# Altium schematic sheet EvaluationV1.0.SchDoc
size 340 x 245 mm
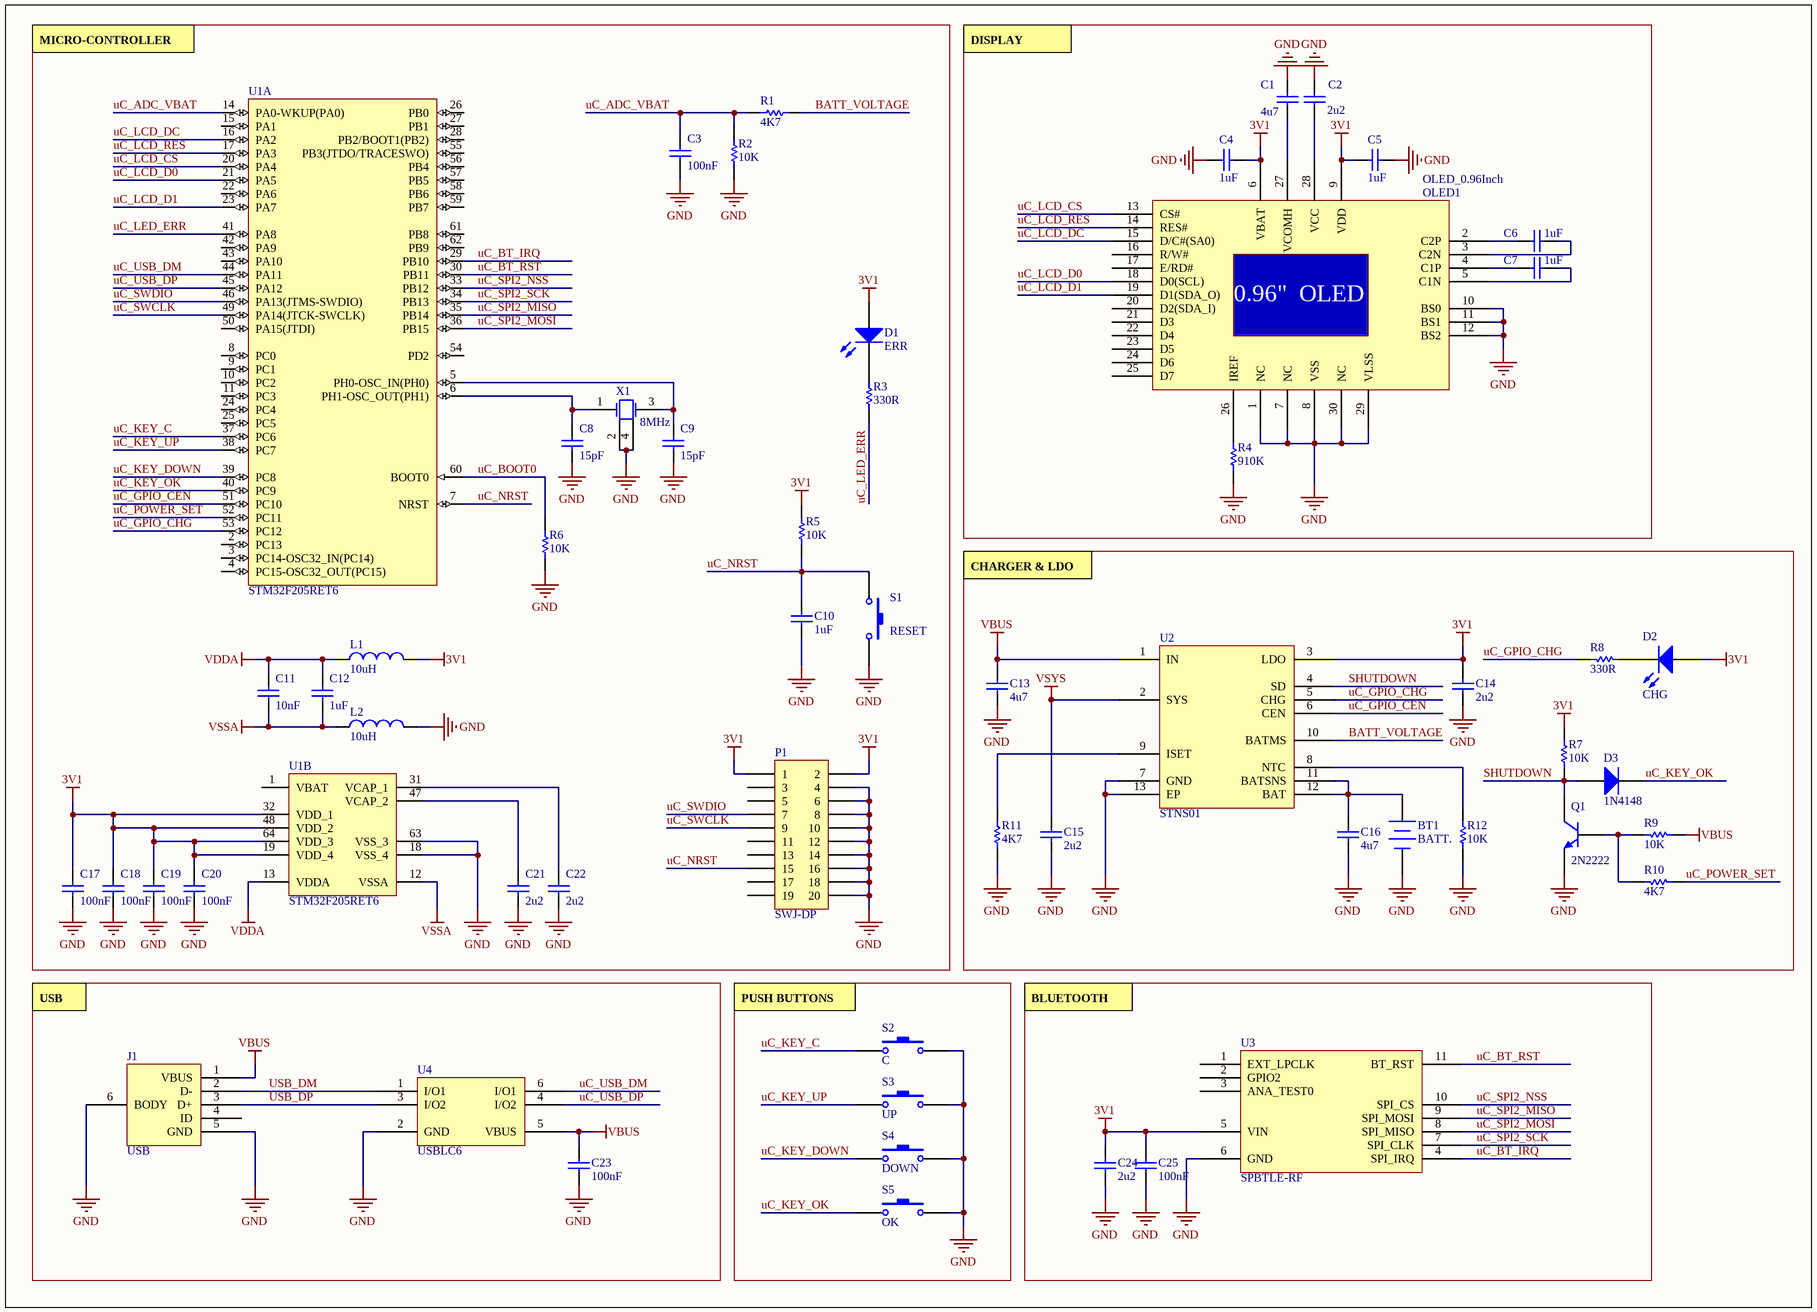
[diagram p0: EvaluationV1.0.SchDoc]

## Parts
BT1  BATT.  [PH B2B]
C1  4u7  [CAP 0805]
C2  2u2  [CAP 0805]
C3  100nF  [CAP 0805]
C4  1uF  [CAP 0805]
C5  1uF  [CAP 0805]
C6  1uF  [CAP 0805]
C7  1uF  [CAP 0805]
C8  15pF  [CAP 0805]
C9  15pF  [CAP 0805]
C10  1uF  [CAP 0805]
C11  10nF  [CAP 0805]
C12  1uF  [CAP 0805]
C13  4u7  [CAP 0805]
C14  2u2  [CAP 0805]
C15  2u2  [CAP 0805]
C16  4u7  [CAP 0805]
C17  100nF  [CAP 0805]
C18  100nF  [CAP 0805]
C19  100nF  [CAP 0805]
C20  100nF  [CAP 0805]
C21  2u2  [CAP 0805]
C22  2u2  [CAP 0805]
C23  100nF  [CAP 0805]
C24  2u2  [CAP 0805]
C25  100nF  [CAP 0805]
D1  ERR  [LED 0805]
D2  CHG  [LED 0805]
D3  1N4148  [DIODE SOD-80]
J1  USB  [USB_MICRO]
L1  10uH  [RES 0805]
L2  10uH  [RES 0805]
OLED1  OLED_0.96Inch  [OLED 0.96"]
P1  SWJ-DP  [BOX 2X10]
Q1  2N2222  [SOT23]
R1  4K7  [RES 0805]
R2  10K  [RES 0805]
R3  330R  [RES 0805]
R4  910K  [RES 0805]
R5  10K  [RES 0805]
R6  10K  [RES 0805]
R7  10K  [RES 0805]
R8  330R  [RES 0805]
R9  10K  [RES 0805]
R10  4K7  [RES 0805]
R11  4K7  [RES 0805]
R12  10K  [RES 0805]
S1  RESET  [SW SMD 6x6x5]
S2  C  [SW SMD 6x6x5]
S3  UP  [SW SMD 6x6x5]
S4  DOWN  [SW SMD 6x6x5]
S5  OK  [SW SMD 6x6x5]
U1  STM32F205RET6  [LQFP64_N]  (parts A,B of 2)
U2  STNS01  [DFN12-3x3]
U3  SPBTLE-RF  [SPBTLE-RF]
U4  USBLC6  [SOT-666]
X1  8MHz  [ABMM2]

## Nets
3V1: C4.2 C5.2 C14.1 C17.2 C18.2 C19.2 C20.2 C24.1 C25.1 D1.1(A) D2.1(A) L1.1 OLED1.6(VBAT) OLED1.9(VDD) P1.1 P1.2 R5.2 R7.1 U1.19(VDD_4) U1.32(VDD_1) U1.48(VDD_2) U1.64(VDD_3) U2.3(LDO) U3.5(VIN)
GND: BT1.2(-) C1.1 C2.1 C3.1 C4.1 C5.1 C8.1 C9.1 C10.2 C13.2 C14.2 C15.2 C16.2 C17.1 C18.1 C19.1 C20.1 C21.1 C22.1 C23.1 C24.2 C25.2 J1.5(GND) J1.6(BODY) L2.1 OLED1.1(NC) OLED1.7(NC) OLED1.8(VSS) OLED1.10(BS0) OLED1.11(BS1) OLED1.12(BS2) OLED1.29(VLSS) OLED1.30(NC) P1.4 P1.6 P1.8 P1.10 P1.12 P1.14 P1.16 P1.18 P1.20 Q1.3(E) R2.2 R4.1 R6.1 R11.1 R12.1 S1.2 S2.2 S3.2 S4.2 S5.2 U1.18(VSS_4) U1.63(VSS_3) U2.7(GND) U2.13(EP) U3.6(GND) U4.2(GND) X1.2 X1.4
VBUS: C13.1 C23.2 J1.1(VBUS) R9.1 U2.1(IN) U4.5(VBUS)
VDDA: C11.2 C12.2 L1.2 U1.13(VDDA)
VSSA: C11.1 C12.1 L2.2 U1.12(VSSA)
VSYS: C15.1 U2.2(SYS)
BATT_VOLTAGE: R1.1 U2.10(BATMS)
SHUTDOWN: D3.1(A) Q1.2(C) R7.2 U2.4(SD)
uC_ADC_VBAT: C3.2 R1.2 R2.1 U1.14(PA0-WKUP(PA0))
uC_BOOT0: R6.2 U1.60(BOOT0)
uC_BT_IRQ: U1.29(PB10) U3.4(SPI_IRQ)
uC_BT_RST: U1.30(PB11) U3.11(BT_RST)
uC_GPIO_CEN: U1.51(PC10) U2.6(CEN)
uC_GPIO_CHG: R8.1 U1.53(PC12) U2.5(CHG)
uC_KEY_C: S2.1 U1.37(PC6)
uC_KEY_DOWN: S4.1 U1.39(PC8)
uC_KEY_OK: D3.2(K) S5.1 U1.40(PC9)
uC_KEY_UP: S3.1 U1.38(PC7)
uC_LCD_CS: OLED1.13(CS#) U1.20(PA4)
uC_LCD_D0: OLED1.18(D0(SCL)) U1.21(PA5)
uC_LCD_D1: OLED1.19(D1(SDA_O)) U1.23(PA7)
uC_LCD_DC: OLED1.15(D/C#(SA0)) U1.16(PA2)
uC_LCD_RES: OLED1.14(RES#) U1.17(PA3)
uC_LED_ERR: R3.2 U1.41(PA8)
uC_NRST: C10.1 P1.15 R5.1 S1.1 U1.7(NRST)
uC_POWER_SET: R10.1 U1.52(PC11)
uC_SPI2_MISO: U1.35(PB14) U3.9(SPI_MOSI)
uC_SPI2_MOSI: U1.36(PB15) U3.8(SPI_MISO)
uC_SPI2_NSS: U1.33(PB12) U3.10(SPI_CS)
uC_SPI2_SCK: U1.34(PB13) U3.7(SPI_CLK)
uC_SWCLK: P1.9 U1.49(PA14(JTCK-SWCLK))
uC_SWDIO: P1.7 U1.46(PA13(JTMS-SWDIO))
uC_USB_DM: U1.44(PA11) U4.6(I/O1)
uC_USB_DP: U1.45(PA12) U4.4(I/O2)
USB_DM: J1.2(D-) U4.1(I/O1)
USB_DP: J1.3(D+) U4.3(I/O2)
NetBT1_1: BT1.1(+) C16.1 U2.11(BATSNS) U2.12(BAT)
NetC1_2: C1.2 OLED1.27(VCOMH)
NetC2_2: C2.2 OLED1.28(VCC)
NetC6_1: C6.1 OLED1.3(C2N)
NetC6_2: C6.2 OLED1.2(C2P)
NetC7_1: C7.1 OLED1.5(C1N)
NetC7_2: C7.2 OLED1.4(C1P)
NetC8_2: C8.2 U1.6(PH1-OSC_OUT(PH1)) X1.1
NetC9_2: C9.2 U1.5(PH0-OSC_IN(PH0)) X1.3
NetC21_2: C21.2 U1.47(VCAP_2)
NetC22_2: C22.2 U1.31(VCAP_1)
NetD1_2: D1.2(K) R3.1
NetD2_2: D2.2(K) R8.2
NetOLED1_26: OLED1.26(IREF) R4.2
NetQ1_1: Q1.1(B) R9.2 R10.2
NetR11_2: R11.2 U2.9(ISET)
NetR12_2: R12.2 U2.8(NTC)

Not connected (* = marked no-connect by the designer): J1 4(ID); OLED1 16(R/W#) 17(E/RD#) 20(D2(SDA_I)) 21(D3) 22(D4) 23(D5) 24(D6) 25(D7); P1 3 5 11 13 17 19; U1 1(VBAT) 2(PC13) 3(PC14-OSC32_IN(PC14)) 4(PC15-OSC32_OUT(PC15)) 8(PC0) 9(PC1) 10(PC2) 11(PC3) 15(PA1) 22(PA6) 24(PC4) 25(PC5) 26(PB0) 27(PB1) 28(PB2/BOOT1(PB2)) 42(PA9) 43(PA10) 50(PA15(JTDI)) 54(PD2) 55(PB3(JTDO/TRACESWO)) 56(PB4) 57(PB5) 58(PB6) 59(PB7) 61(PB8) 62(PB9); U3 1(EXT_LPCLK) 2(GPIO2) 3(ANA_TEST0)

## Notes on the sheet
- MICRO-CONTROLLER
- DISPLAY
- CHARGER & LDO
- USB
- (near S2) PUSH BUTTONS
- BLUETOOTH
- (in symbol OLED_0.96) 0.96"  OLED

## Library data of the parts
BT1 = Battery: Multicell Battery; Published: 24-Mar-1999; LatestRevisionDate: 17-Jul-2002; LatestRevisionNote: Re-released for DXP Platform.; PackageReference: BAT-2; Publisher: Altium Limited; PackageDescription: Battery; 2 Leads
C1-C25 = CAP: Multi Layer Capacitor
D1 D2 = LED2: Typical RED, GREEN, YELLOW, AMBER GaAs LED; Published: 8-Jun-2000; LatestRevisionDate: 17-Jul-2002; LatestRevisionNote: Re-released for DXP Platform.; PackageVersion: Feb-2002; PackageReference: 3.2X1.6X1.1; Publisher: Altium Limited; PackageDescription: SM LED; 2 Flat Leads
D3 = DIODE
J1 = USB MICRO: Micro USB Connector
L1 L2 = INDUCTOR
OLED1 = OLED_0.96
P1 = Header 10X2: Header, 10-Pin, Dual row; LatestRevisionDate: 17-Jul-2002; LatestRevisionNote: Re-released for DXP Platform.; Publisher: Altium Limited
Q1 = NPN: NPN Transistor
R1-R12 = RES: Resistor
S1-S5 = SW-PB: Switch; Published: 24-Mar-1999; LatestRevisionDate: 17-Jul-2002; LatestRevisionNote: Re-released for DXP Platform.; PackageReference: SPST-2; Publisher: Altium Limited; PackageDescription: Switch; 2 Leads
U1 = STM32F205RET6: ARM Cortex-M3 32-bit MCU, 512 KB Flash, 128 KB Internal RAM, 51 I/Os, 64-pin LQFP, -40 to 85 degC, Tray; D/A Converter: 2x12-bit (2 Channel); FLASH Size (Prog) (kB): 512; I/Os (High Current): 51; Internal RAM Size (kB): 128; Operating Frequency(F) (Processor speed) (MHz): 120; Supply Voltage(Vcc) min (V): 1.8; DatasheetVersion: Rev. 9; PackageVersion: Rev. 4, 06/2013; PackageReference: LQFP64; PackageDescription: 64-Pin Low Profile Quad Flat Package, 10 x 10 mm Body, 0.5 mm Pitch; Supplier 1: Digi-Key; Supplier Part Number 1: 497-11155-ND; Supplier 2: Farnell; Supplier Part Number 2: 2060897; Supplier 3: Newark; Supplier Part Number 3: 47T9329; Supplier 4: Mouser; Supplier Part Number 4: 511-STM32F205RET6; Core: ARM Cortex-M3; Packing: Tray; Mounting Technology: Surface Mount; PartNumber: STM32F205RET6; ComponentLink1Description: Manufacturer URL; ComponentLink1URL: http://www.st.com/web/en/home.html; ComponentLink2Description: Datasheet; ComponentLink2URL: http://www.st.com/st-web-ui/static/active/en/resource/technical/document/datasheet/CD00237391.pdf; ComponentLink3Description: Package Specification; ComponentLink3URL: http://www.st.com/st-web-ui/static/active/en/resource/technical/document/datasheet/DM00037051.pdf
U2 = STNS01: Li-Ion linear battery charger with LDO
U3 = SPBTLE-RF: Very low power network processor module for Bluetooth® low / energy v4.1
U4 = USBLC6: ESD Protection for USB 2.0
X1 = XTAL2